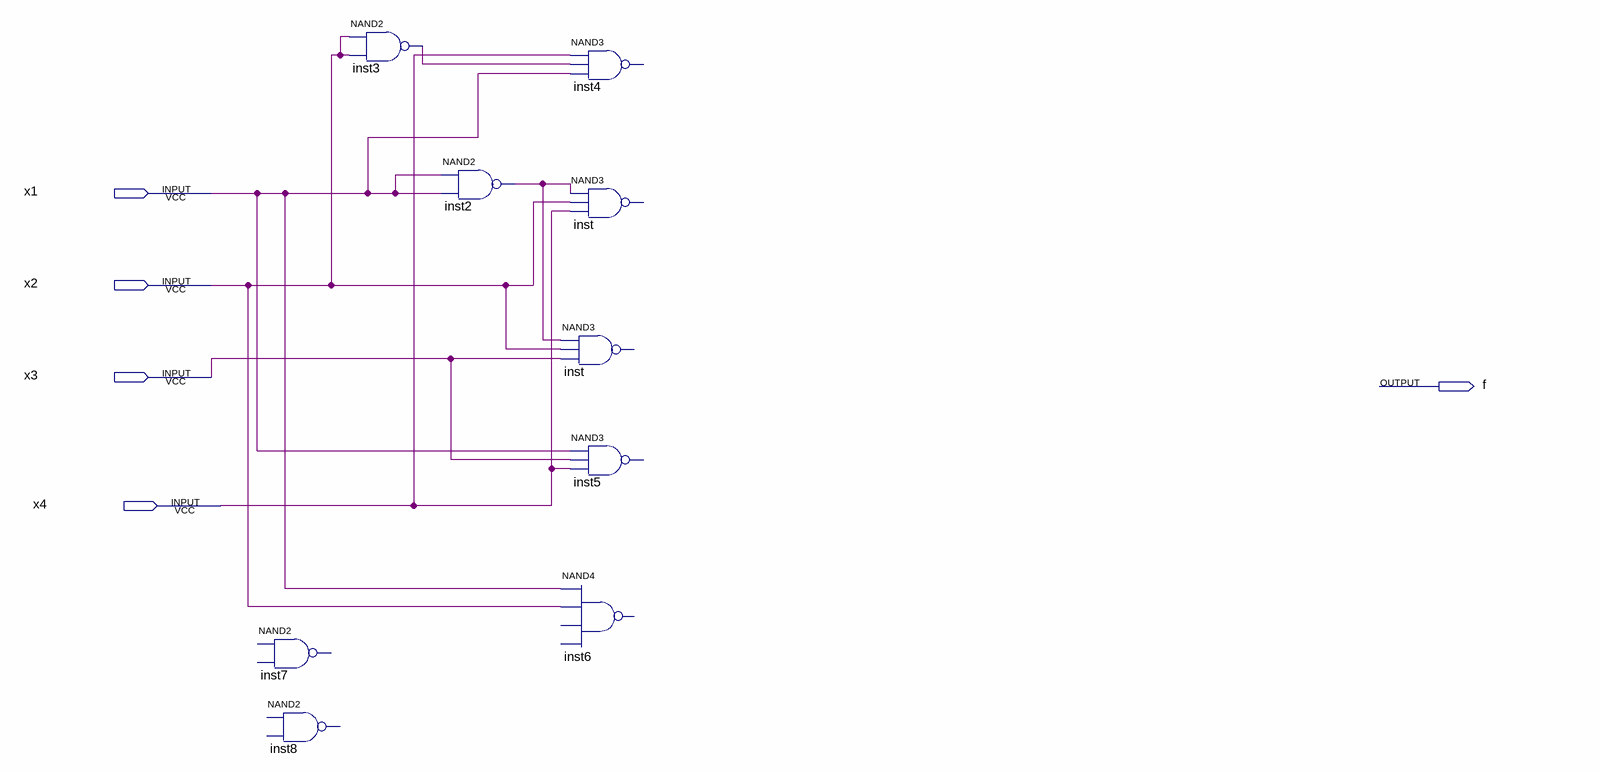
[diagram p0: schematic sheet]
// Quartus schematic lab2_test.bdf as structural Verilog: 9 symbols, 5 pins
module lab2_test (
  input  x1,
  input  x2,
  input  x3,
  input  x4,
  output f
);

  wire inst2_out, inst3_out;

  // NAND2 inst7 is placed but not wired
  // NAND2 inst8 is placed but not wired
  nand inst3 (inst3_out, x2, x2);
  nand inst2 (inst2_out, x1, x1);
  // NAND3 inst has open pins: IN1=inst2_out, IN2=x2, IN3=x3, OUT=open
  // NAND4 inst6 has open pins: IN1=x1, IN2=x2, IN3=open, IN4=open, OUT=open
  // NAND3 inst4 has open pins: IN1=x4, IN2=inst3_out, IN3=x1, OUT=open
  // NAND3 inst has open pins: IN1=inst2_out, IN2=x2, IN3=x4, OUT=open
  // NAND3 inst5 has open pins: IN1=x1, IN2=x3, IN3=x4, OUT=open
endmodule
